# EAGLE schematic Schematic (EAGLE 8.7.1)
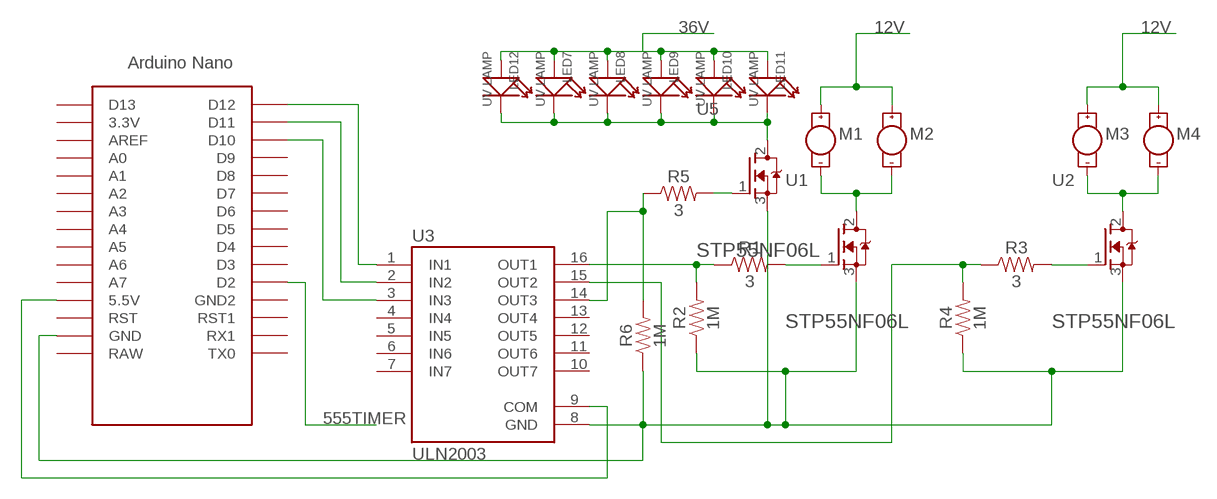
[diagram p0: schematic, sheet 1]

## Parts
LED7  UV LAMP  DIP-LED-RED-RED-10MM(2P-D10MM)  [LED2-2.54-D10MM]
LED8  UV LAMP  DIP-LED-RED-RED-10MM(2P-D10MM)  [LED2-2.54-D10MM]
LED9  UV LAMP  DIP-LED-RED-RED-10MM(2P-D10MM)  [LED2-2.54-D10MM]
LED10  UV LAMP  DIP-LED-RED-RED-10MM(2P-D10MM)  [LED2-2.54-D10MM]
LED11  UV LAMP  DIP-LED-RED-RED-10MM(2P-D10MM)  [LED2-2.54-D10MM]
LED12  UV LAMP  DIP-LED-RED-RED-10MM(2P-D10MM)  [LED2-2.54-D10MM]
M1  MOTOR10MM  [VIBE-MOTOR-10MM]
M2  MOTOR10MM  [VIBE-MOTOR-10MM]
M3  MOTOR10MM  [VIBE-MOTOR-10MM]
M4  MOTOR10MM  [VIBE-MOTOR-10MM]
R1  3  0.1OHM-1210-1/2W-1%  [1210]
R2  1M  0.1OHM-1210-1/2W-1%  [1210]
R3  3  0.1OHM-1210-1/2W-1%  [1210]
R4  1M  0.1OHM-1210-1/2W-1%  [1210]
R5  3  0.1OHM-1210-1/2W-1%  [1210]
R6  1M  0.1OHM-1210-1/2W-1%  [1210]
U1  STP55NF06L  [TO254P1040X460X1935-3]
U2  STP55NF06L  [TO254P1040X460X1935-3]
U3  ULN2003  [DIP762W46P254L1969H533Q16]
U5  STP55NF06L  [TO254P1040X460X1935-3]
U$1  NANO  [NANO]

## Nets
12V: M1.+ M2.+ M3.+ M4.+
36V: LED7.+ LED8.+ LED9.+ LED10.+ LED11.+ LED12.+
555TIMER: U$1.D2
GND: R2.1 R4.1 R6.1 U1.3(S) U2.3(S) U3.8(GND) U5.3(S) U$1.GND
N$1: M1.- M2.- U1.2(D)
N$2: M3.- M4.- U2.2(D)
N$3: R1.2 U1.1(G)
N$4: R1.1 R2.2 U3.16(OUT1)
N$5: R3.2 U2.1(G)
N$6: R3.1 R4.2 U3.15(OUT2)
N$7: U3.1(IN1) U$1.D12
N$8: U3.2(IN2) U$1.D11
N$9: U3.3(IN3) U$1.D10
N$11: LED7.- LED8.- LED9.- LED10.- LED11.- LED12.- U5.2(D)
N$12: R5.2 U5.1(G)
N$13: R5.1 R6.2 U3.14(OUT3)
N$14: U3.9(COM) U$1.5V(5.5V)
Unconnected: U3.4(IN4) U3.5(IN5) U3.6(IN6) U3.7(IN7) U3.10(OUT7) U3.11(OUT6) U3.12(OUT5) U3.13(OUT4) U$1.3.3V U$1.A0 U$1.A1 U$1.A2 U$1.A3 U$1.A4 U$1.A5 U$1.A6 U$1.A7 U$1.AREF U$1.D3 U$1.D4 U$1.D5 U$1.D6 U$1.D7 U$1.D8 U$1.D9 U$1.D13 U$1.GND1(GND2) U$1.ICSP1 U$1.ICSP2 U$1.ICSP3 U$1.ICSP4 U$1.ICSP5 U$1.ICSP6 U$1.RAW U$1.RST U$1.RST1 U$1.RX1 U$1.TX0

## Library data of the parts
LED7-LED12 = DIP-LED-RED-RED-10MM_2P-D10MM_:DIP-LED-RED-RED-10MM(2P-D10MM): 304090130; AVAILABILITY: Unavailable; DESCRIPTION: DIP LED Red-Red-10mm; MF: Chengguangxing; MP: SR1004DC; PACKAGE: None; PRICE: None
M1-M4 = SparkFun-Electromechanical:MOTOR: Motor (Single-Phase) Two-terminal, single-phase motors. SparkFun Products Vibration Motor <https://www.sparkfun.com/products/8449> (ROB-08449) Physical dimension and wire connections for this powerful vibration motor. Motor has a self adhesive backing.; PROD_ID: COMP-08572; SF_SKU: ROB-08449
R1-R6 = SparkFun-Resistors:0.1OHM: 0.1Ω resistor A resistor is a passive two-terminal electrical component that implements electrical resistance as a circuit element. Resistors act to reduce current flow, and, at the same time, act to lower voltage levels within circuits. - Wikipedia; PROD_ID: RES-12374; VALUE: 0.1
U1 U2 U5 = STP55NF06L:STP55NF06L: N-channel 60 V, 0.014 Ohm typ., 35 A StripFET II Power MOSFET in a TO-220 package; AVAILABILITY: Unavailable; DESCRIPTION: N-channel 60 V, 0.014 Ohm typ., 35 A StripFET II Power MOSFET in a TO-220 package; MF: STMicroelectronics; MP: STP55NF06L; PACKAGE: TO-220 STMicroelectronics; PRICE: None
U3 = ULN2003:ULN2003: Seven Darlington array; AVAILABILITY: Unavailable; DESCRIPTION: Bipolar (BJT) Transistor Array 7 NPN Darlington 50V 500mA Surface Mount 16-SOIC; MF: ON Semiconductor; MP: ULN2003; PACKAGE: SOIC-16 ON Semiconductor; PRICE: None
U$1 = Arduino-clone:NANO: Arduino Nano